# Altium schematic sheet Mako DSP Pro Main R1.0.SchDoc
size D
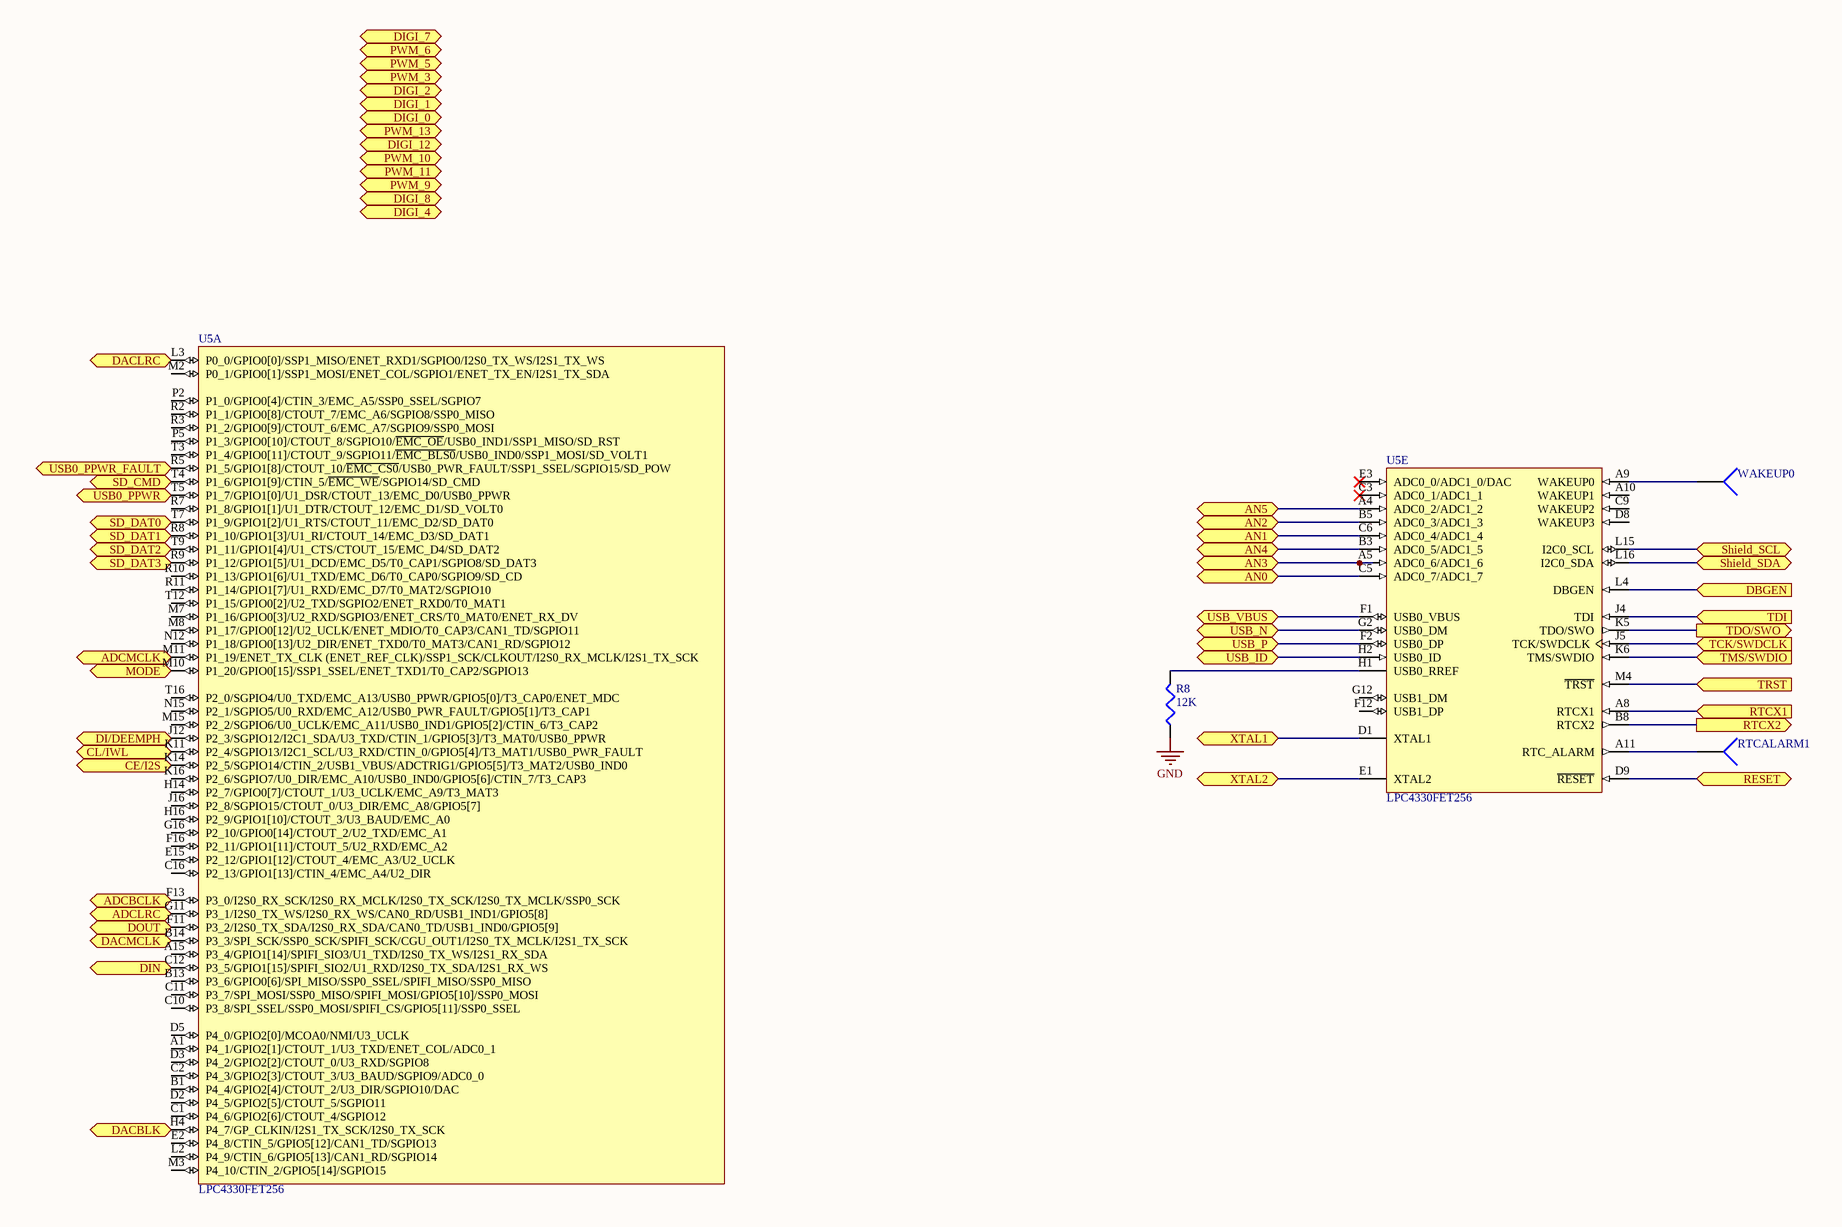
[diagram p0: Mako DSP Pro Main R1.0.SchDoc, top left]
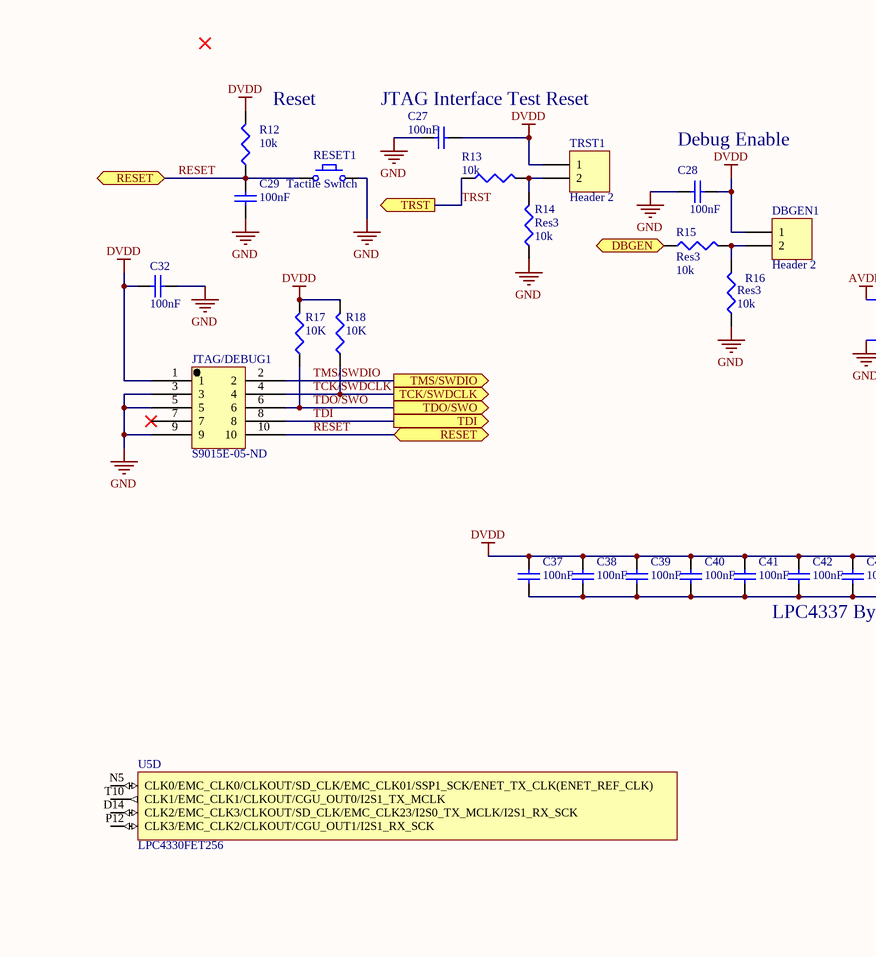
[diagram p1: Mako DSP Pro Main R1.0.SchDoc, bottom left]
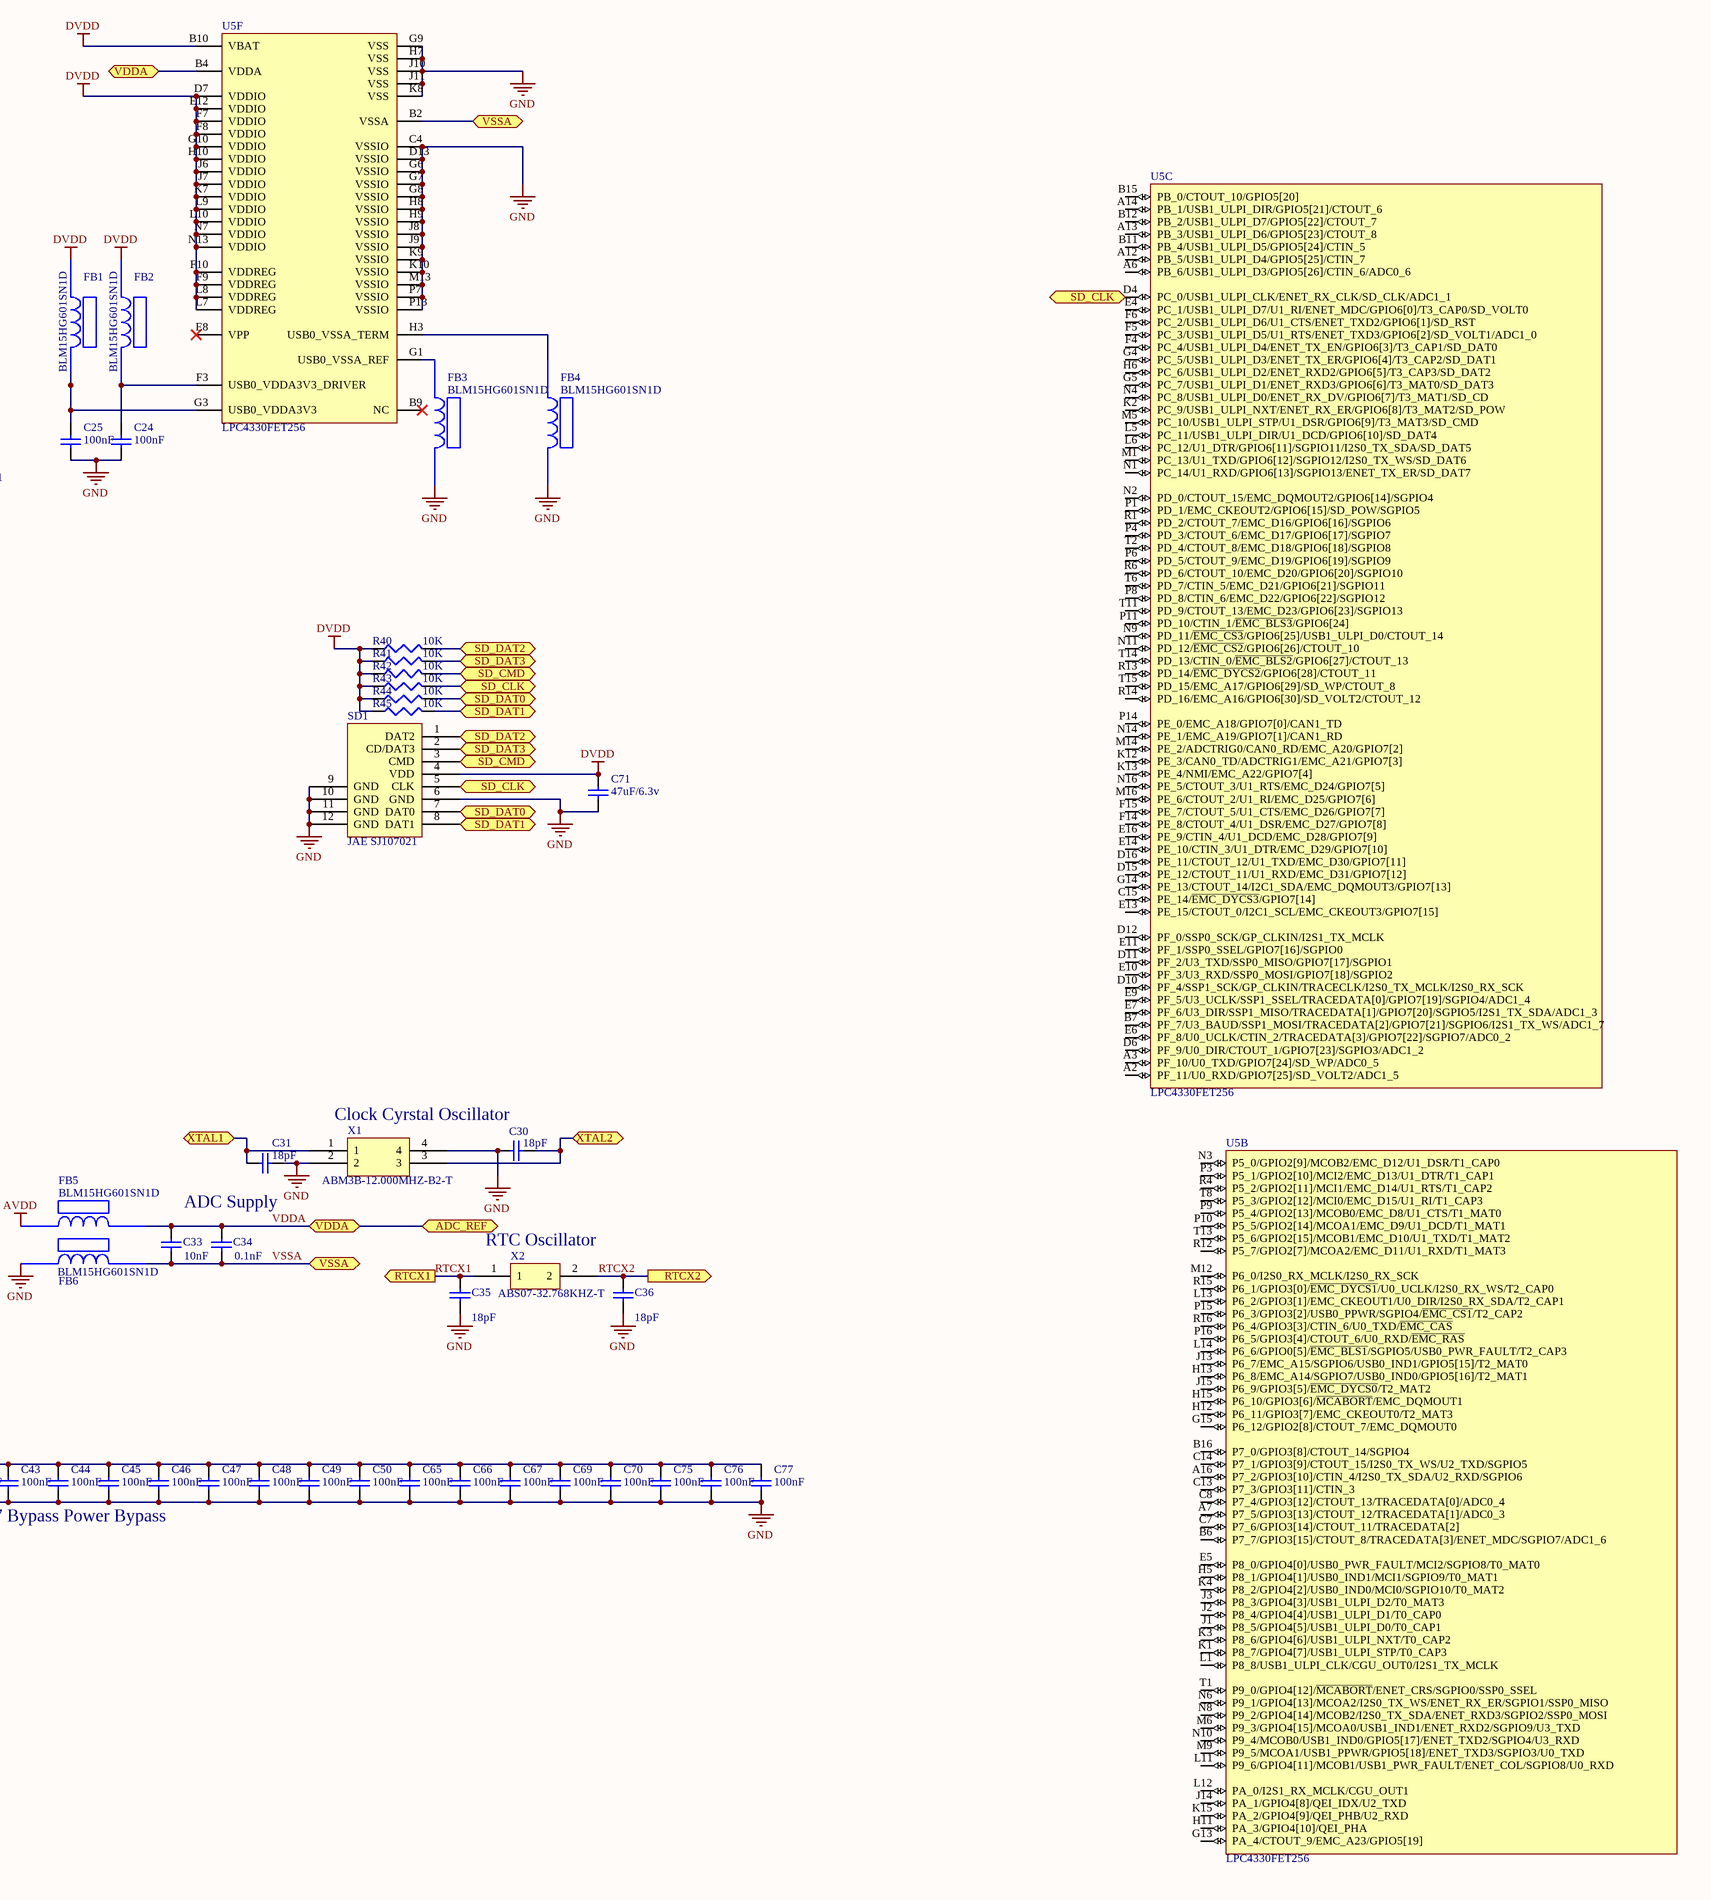
[diagram p2: Mako DSP Pro Main R1.0.SchDoc, bottom right]

## Parts
C24  value 100nF  [0402]  (hidden comment: Cap Semi)
C25  value 100nF  [0402]  (hidden comment: Cap Semi)
C27  C1: 100nF  [CAPC1608L]  (hidden comment: Cap Semi)
C28  C1: 100nF  [CAPC1608L]  (hidden comment: Cap Semi)
C29  C1: 100nF  [CAPC1608L]  (hidden comment: Cap Semi)
C30  value 18pF  [1608[0603]]  (hidden comment: Cap Semi)
C31  value 18pF  [1608[0603]]  (hidden comment: Cap Semi)
C32  C1: 100nF  [CAPC1608L]  (hidden comment: Cap Semi)
C33  value 10nF  [1608[0603]]  (hidden comment: Cap Semi)
C34  value 0.1nF  [1608[0603]]  (hidden comment: Cap Semi)
C35  value 18pF  [1608[0603]]  (hidden comment: Cap Semi)
C36  value 18pF  [1608[0603]]  (hidden comment: Cap Semi)
C37  value 100nF  [0402]  (hidden comment: Cap Semi)
C38  value 100nF  [0402]  (hidden comment: Cap Semi)
C39  value 100nF  [0402]  (hidden comment: Cap Semi)
C40  value 100nF  [0402]  (hidden comment: Cap Semi)
C41  value 100nF  [0402]  (hidden comment: Cap Semi)
C42  value 100nF  [0402]  (hidden comment: Cap Semi)
C43  value 100nF  [0402]  (hidden comment: Cap Semi)
C44  value 100nF  [0402]  (hidden comment: Cap Semi)
C45  value 100nF  [0402]  (hidden comment: Cap Semi)
C46  value 100nF  [0402]  (hidden comment: Cap Semi)
C47  value 100nF  [0402]  (hidden comment: Cap Semi)
C48  value 100nF  [0402]  (hidden comment: Cap Semi)
C49  value 100nF  [0402]  (hidden comment: Cap Semi)
C50  value 100nF  [0402]  (hidden comment: Cap Semi)
C65  value 100nF  [0402]  (hidden comment: Cap Semi)
C66  value 100nF  [0402]  (hidden comment: Cap Semi)
C67  value 100nF  [0402]  (hidden comment: Cap Semi)
C69  value 100nF  [0402]  (hidden comment: Cap Semi)
C70  value 100nF  [0402]  (hidden comment: Cap Semi)
C71  value 47uF/6.3v  [Panasonic VS B]  (hidden comment: Cap Semi)
C75  value 100nF  [0402]  (hidden comment: Cap Semi)
C76  value 100nF  [0402]  (hidden comment: Cap Semi)
C77  value 100nF  [0402]  (hidden comment: Cap Semi)
DBGEN1  Header 2  [HDR1X2]
FB1  BLM15HG601SN1D  [BLM18PG121SN1D]
FB2  BLM15HG601SN1D  [BLM18PG121SN1D]
FB3  BLM15HG601SN1D  [BLM18PG121SN1D]
FB4  BLM15HG601SN1D  [BLM18PG121SN1D]
FB5  BLM15HG601SN1D  [BLM18PG121SN1D]
FB6  BLM15HG601SN1D  [BLM18PG121SN1D]
JTAG/DEBUG1  S9015E-05-ND  [S9015E-05-ND]
R8  value 12K  [J1-0603]  (hidden comment: Res3)
R12  value 10k  [J1-0603]  (hidden comment: Res3)
R13  value 10k  [J1-0603]  (hidden comment: Res3)
R14  Res3  value 10k  [J1-0603]
R15  Res3  value 10k  [J1-0603]
R16  Res3  value 10k  [J1-0603]
R17  value 10K  [J1-0603]  (hidden comment: Res3)
R18  value 10K  [J1-0603]  (hidden comment: Res3)
R40  value 10K  [J1-0603]  (hidden comment: Res3)
R41  value 10K  [J1-0603]  (hidden comment: Res3)
R42  value 10K  [J1-0603]  (hidden comment: Res3)
R43  value 10K  [J1-0603]  (hidden comment: Res3)
R44  value 10K  [J1-0603]  (hidden comment: Res3)
R45  value 10K  [J1-0603]  (hidden comment: Res3)
RESET1  Tactile Switch  [TL3301]
RTCALARM1  Socket  [PIN1]  (value not drawn)
SD1  JAE SJ107021  [JAE SJ107021]
TRST1  Header 2  [HDR1X2]
U5  LPC4330FET256  [SOT740-2]  (parts A,B,C,D,E,F of 6)
WAKEUP0  Socket  [PIN1]  (value not drawn)
X1  ABM3B-12.000MHZ-B2-T  [ABM3B-12.000MHZ-B2-T]
X2  ABS07-32.768KHZ-T  [ABS07-32.768KHZ-T]

## Ports
ADC_REF, ADCBCLK (bidir), ADCLRC (bidir), ADCMCLK (bidir), AN0 (bidir), AN1 (bidir), AN2 (bidir), AN3 (bidir), AN4 (bidir), AN5 (bidir), CE/I2S (bidir), CL/IWL (bidir), DACBLK (bidir), DACLRC (bidir), DACMCLK (bidir), DBGEN (in), DBGEN (out), DI/DEEMPH (bidir), DIGI_0 (bidir), DIGI_1 (bidir), DIGI_2 (bidir), DIGI_4 (bidir), DIGI_7 (bidir), DIGI_8 (bidir), DIGI_12 (bidir), DIN (bidir), DOUT (bidir), MODE (bidir), PWM_3 (bidir), PWM_5 (bidir), PWM_6 (bidir), PWM_9 (bidir), PWM_10 (bidir), PWM_11 (bidir), PWM_13 (bidir), RESET (bidir), RTCX1 (in), RTCX1 (out), RTCX2 (out), SD_CLK (bidir), SD_CMD (bidir), SD_DAT0 (bidir), SD_DAT1 (bidir), SD_DAT2 (bidir), SD_DAT3 (bidir), Shield_SCL (bidir), Shield_SDA (bidir), TCK/SWDCLK (in), TCK/SWDCLK (out), TDI (in), TDI (out), TDO/SWO (out), TMS/SWDIO (in), TMS/SWDIO (out), TRST (in), TRST (out), USB0_PPWR (bidir), USB0_PPWR_FAULT (bidir), USB_ID (bidir), USB_N (bidir), USB_P (bidir), USB_VBUS (bidir), VDDA, VSSA, XTAL1 (bidir), XTAL2 (bidir)

## Nets
AVDD: FB5.1
DVDD: C27.2 C28.2 C32.1 C37.2 C38.2 C39.2 C40.2 C41.2 C42.2 C43.2 C44.2 C45.2 C46.2 C47.2 C48.2 C49.2 C50.2 C65.2 C66.2 C67.2 C69.2 C70.2 C71.2 C75.2 C76.2 C77.2 DBGEN1.1 FB1.1 FB2.1 JTAG/DEBUG1.1 R12.2 R17.2 R18.2 R40.1 R41.1 R42.1 R43.1 R44.1 R45.1 SD1.4(VDD) TRST1.1 U5.B10(VBAT) U5.D7(VDDIO) U5.E12(VDDIO) U5.F7(VDDIO) U5.F8(VDDIO) U5.F9(VDDREG) U5.F10(VDDREG) U5.G10(VDDIO) U5.H10(VDDIO) U5.J6(VDDIO) U5.J7(VDDIO) U5.K7(VDDIO) U5.L7(VDDREG) U5.L8(VDDREG) U5.L9(VDDIO) U5.L10(VDDIO) U5.N7(VDDIO) U5.N13(VDDIO)
GND: C24.1 C25.1 C27.1 C28.1 C29.1 C30.2 C31.1 C32.2 C35.1 C36.1 C37.1 C38.1 C39.1 C40.1 C41.1 C42.1 C43.1 C44.1 C45.1 C46.1 C47.1 C48.1 C49.1 C50.1 C65.1 C66.1 C67.1 C69.1 C70.1 C71.1 C75.1 C76.1 C77.1 FB3.2 FB4.2 FB6.1 JTAG/DEBUG1.3 JTAG/DEBUG1.5 JTAG/DEBUG1.9 R8.1 R14.1 R16.1 RESET1.2 SD1.6(GND) SD1.9(GND) SD1.10(GND) SD1.11(GND) SD1.12(GND) U5.C4(VSSIO) U5.D13(VSSIO) U5.G6(VSSIO) U5.G7(VSSIO) U5.G8(VSSIO) U5.G9(VSS) U5.H7(VSS) U5.H8(VSSIO) U5.H9(VSSIO) U5.J8(VSSIO) U5.J9(VSSIO) U5.J10(VSS) U5.J11(VSS) U5.K8(VSS) U5.K9(VSSIO) U5.K10(VSSIO) U5.M13(VSSIO) U5.P7(VSSIO) U5.P13(VSSIO) X1.2 X1.4
ADCBCLK: U5.F13(P3_0/I2S0_RX_SCK/I2S0_RX_MCLK/I2S0_TX_SCK/I2S0_TX_MCLK/SSP0_SCK) ; port ADCBCLK
ADCLRC: U5.G11(P3_1/I2S0_TX_WS/I2S0_RX_WS/CAN0_RD/USB1_IND1/GPIO5[8]) ; port ADCLRC
ADCMCLK: U5.M11(P1_19/ENET_TX_CLK_(ENET_REF_CLK)/SSP1_SCK/CLKOUT/I2S0_RX_MCLK/I2S1_TX_SCK) ; port ADCMCLK
AN0: U5.C5(ADC0_7/ADC1_7) ; port AN0
AN1: U5.C6(ADC0_4/ADC1_4) ; port AN1
AN2: U5.B5(ADC0_3/ADC1_3) ; port AN2
AN3: U5.A5(ADC0_6/ADC1_6) ; port AN3
AN4: U5.B3(ADC0_5/ADC1_5) ; port AN4
AN5: U5.A4(ADC0_2/ADC1_2) ; port AN5
CE/I2S: U5.K14(P2_5/SGPIO14/CTIN_2/USB1_VBUS/ADCTRIG1/GPIO5[5]/T3_MAT2/USB0_IND0) ; port CE/I2S
CL/IWL: U5.K11(P2_4/SGPIO13/I2C1_SCL/U3_RXD/CTIN_0/GPIO5[4]/T3_MAT1/USB0_PWR_FAULT) ; port CL/IWL
DACBLK: U5.H4(P4_7/GP_CLKIN/I2S1_TX_SCK/I2S0_TX_SCK) ; port DACBLK
DACLRC: U5.L3(P0_0/GPIO0[0]/SSP1_MISO/ENET_RXD1/SGPIO0/I2S0_TX_WS/I2S1_TX_WS) ; port DACLRC
DACMCLK: U5.B14(P3_3/SPI_SCK/SSP0_SCK/SPIFI_SCK/CGU_OUT1/I2S0_TX_MCLK/I2S1_TX_SCK) ; port DACMCLK
DBGEN: R15.1 U5.L4(DBGEN) ; port DBGEN
DI/DEEMPH: U5.J12(P2_3/SGPIO12/I2C1_SDA/U3_TXD/CTIN_1/GPIO5[3]/T3_MAT0/USB0_PPWR) ; port DI/DEEMPH
DIN: U5.C12(P3_5/GPIO1[15]/SPIFI_SIO2/U1_RXD/I2S0_TX_SDA/I2S1_RX_WS) ; port DIN
DOUT: U5.F11(P3_2/I2S0_TX_SDA/I2S0_RX_SDA/CAN0_TD/USB1_IND0/GPIO5[9]) ; port DOUT
MODE: U5.M10(P1_20/GPIO0[15]/SSP1_SSEL/ENET_TXD1/T0_CAP2/SGPIO13) ; port MODE
RESET: C29.2 JTAG/DEBUG1.10 R12.1 RESET1.1 U5.D9(~{RESET}) ; port RESET
RTCX1: C35.2 U5.A8(RTCX1) X2.1 ; port RTCX1
RTCX2: C36.2 U5.B8(RTCX2) X2.2 ; port RTCX2
SD_CLK: R43.2 SD1.5(CLK) U5.D4(PC_0/USB1_ULPI_CLK/ENET_RX_CLK/SD_CLK/ADC1_1) ; port SD_CLK
SD_CMD: R42.2 SD1.3(CMD) U5.T4(P1_6/GPIO1[9]/CTIN_5/~{EMC_WE}/SGPIO14/SD_CMD) ; port SD_CMD
SD_DAT0: R44.2 SD1.7(DAT0) U5.T7(P1_9/GPIO1[2]/U1_RTS/CTOUT_11/EMC_D2/SD_DAT0) ; port SD_DAT0
SD_DAT1: R45.2 SD1.8(DAT1) U5.R8(P1_10/GPIO1[3]/U1_RI/CTOUT_14/EMC_D3/SD_DAT1) ; port SD_DAT1
SD_DAT2: R40.2 SD1.1(DAT2) U5.T9(P1_11/GPIO1[4]/U1_CTS/CTOUT_15/EMC_D4/SD_DAT2) ; port SD_DAT2
SD_DAT3: R41.2 SD1.2(CD/DAT3) U5.R9(P1_12/GPIO1[5]/U1_DCD/EMC_D5/T0_CAP1/SGPIO8/SD_DAT3) ; port SD_DAT3
Shield_SCL: U5.L15(I2C0_SCL) ; port Shield_SCL
Shield_SDA: U5.L16(I2C0_SDA) ; port Shield_SDA
TCK/SWDCLK: JTAG/DEBUG1.4 R18.1 U5.J5(TCK/SWDCLK) ; port TCK/SWDCLK
TDI: JTAG/DEBUG1.8 U5.J4(TDI) ; port TDI
TDO/SWO: JTAG/DEBUG1.6 R17.1 U5.K5(TDO/SWO) ; port TDO/SWO
TMS/SWDIO: JTAG/DEBUG1.2 U5.K6(TMS/SWDIO) ; port TMS/SWDIO
TRST: R13.1 U5.M4(~{TRST}) ; port TRST
USB0_PPWR: U5.T5(P1_7/GPIO1[0]/U1_DSR/CTOUT_13/EMC_D0/USB0_PPWR) ; port USB0_PPWR
USB0_PPWR_FAULT: U5.R5(P1_5/GPIO1[8]/CTOUT_10/~{EMC_CS0}/USB0_PWR_FAULT/SSP1_SSEL/SGPIO15/SD_POW) ; port USB0_PPWR_FAULT
USB_ID: U5.H2(USB0_ID) ; port USB_ID
USB_N: U5.G2(USB0_DM) ; port USB_N
USB_P: U5.F2(USB0_DP) ; port USB_P
USB_VBUS: U5.F1(USB0_VBUS) ; port USB_VBUS
VDDA: C33.2 C34.2 FB5.2 U5.B4(VDDA) ; port VDDA, port ADC_REF
VSSA: C33.1 C34.1 FB6.2 U5.B2(VSSA) ; port VSSA
XTAL1: C31.2 U5.D1(XTAL1) X1.1 ; port XTAL1
XTAL2: C30.1 U5.E1(XTAL2) X1.3 ; port XTAL2
NetC24_2: C24.2 FB2.2 U5.F3(USB0_VDDA3V3_DRIVER)
NetC25_2: C25.2 FB1.2 U5.G3(USB0_VDDA3V3)
NetDBGEN1_2: DBGEN1.2 R15.2 R16.2
NetFB3_1: FB3.1 U5.G1(USB0_VSSA_REF)
NetFB4_1: FB4.1 U5.H3(USB0_VSSA_TERM)
NetR8_2: R8.2 U5.H1(USB0_RREF)
NetR13_2: R13.2 R14.2 TRST1.2
NetRTCALARM1_1: RTCALARM1.1 U5.A11(RTC_ALARM)
NetU5_A9: U5.A9(WAKEUP0) WAKEUP0.1

Not connected (* = marked no-connect by the designer): JTAG/DEBUG1 7*; U5 A1(P4_1/GPIO2[1]/CTOUT_1/U3_TXD/ENET_COL/ADC0_1) A2(PF_11/U0_RXD/GPIO7[25]/SD_VOLT2/ADC1_5) A3(PF_10/U0_TXD/GPIO7[24]/SD_WP/ADC0_5) A6(PB_6/USB1_ULPI_D3/GPIO5[26]/CTIN_6/ADC0_6) A7(P7_5/GPIO3[13]/CTOUT_12/TRACEDATA[1]/ADC0_3) A10(WAKEUP1) A12(PB_5/USB1_ULPI_D4/GPIO5[25]/CTIN_7) A13(PB_3/USB1_ULPI_D6/GPIO5[23]/CTOUT_8) A14(PB_1/USB1_ULPI_DIR/GPIO5[21]/CTOUT_6) A15(P3_4/GPIO1[14]/SPIFI_SIO3/U1_TXD/I2S0_TX_WS/I2S1_RX_SDA) A16(P7_2/GPIO3[10]/CTIN_4/I2S0_TX_SDA/U2_RXD/SGPIO6) B1(P4_4/GPIO2[4]/CTOUT_2/U3_DIR/SGPIO10/DAC) B6(P7_7/GPIO3[15]/CTOUT_8/TRACEDATA[3]/ENET_MDC/SGPIO7/ADC1_6) B7(PF_7/U3_BAUD/SSP1_MOSI/TRACEDATA[2]/GPIO7[21]/SGPIO6/I2S1_TX_WS/ADC1_7) B9(NC)* B11(PB_4/USB1_ULPI_D5/GPIO5[24]/CTIN_5) B12(PB_2/USB1_ULPI_D7/GPIO5[22]/CTOUT_7) B13(P3_6/GPIO0[6]/SPI_MISO/SSP0_SSEL/SPIFI_MISO/SSP0_MISO) B15(PB_0/CTOUT_10/GPIO5[20]) B16(P7_0/GPIO3[8]/CTOUT_14/SGPIO4) C1(P4_6/GPIO2[6]/CTOUT_4/SGPIO12) C2(P4_3/GPIO2[3]/CTOUT_3/U3_BAUD/SGPIO9/ADC0_0) C3(ADC0_1/ADC1_1)* C7(P7_6/GPIO3[14]/CTOUT_11/TRACEDATA[2]) C8(P7_4/GPIO3[12]/CTOUT_13/TRACEDATA[0]/ADC0_4) C9(WAKEUP2) C10(P3_8/SPI_SSEL/SSP0_MOSI/SPIFI_CS/GPIO5[11]/SSP0_SSEL) C11(P3_7/SPI_MOSI/SSP0_MISO/SPIFI_MOSI/GPIO5[10]/SSP0_MOSI) C13(P7_3/GPIO3[11]/CTIN_3) C14(P7_1/GPIO3[9]/CTOUT_15/I2S0_TX_WS/U2_TXD/SGPIO5) C15(PE_14/~{EMC_DYCS3}/GPIO7[14]) C16(P2_13/GPIO1[13]/CTIN_4/EMC_A4/U2_DIR) D2(P4_5/GPIO2[5]/CTOUT_5/SGPIO11) D3(P4_2/GPIO2[2]/CTOUT_0/U3_RXD/SGPIO8) D5(P4_0/GPIO2[0]/MCOA0/NMI/U3_UCLK) D6(PF_9/U0_DIR/CTOUT_1/GPIO7[23]/SGPIO3/ADC1_2) D8(WAKEUP3) D10(PF_4/SSP1_SCK/GP_CLKIN/TRACECLK/I2S0_TX_MCLK/I2S0_RX_SCK) D11(PF_2/U3_TXD/SSP0_MISO/GPIO7[17]/SGPIO1) D12(PF_0/SSP0_SCK/GP_CLKIN/I2S1_TX_MCLK) D14(CLK2/EMC_CLK3/CLKOUT/SD_CLK/EMC_CLK23/I2S0_TX_MCLK/I2S1_RX_SCK) D15(PE_12/CTOUT_11/U1_RXD/EMC_D31/GPIO7[12]) D16(PE_11/CTOUT_12/U1_TXD/EMC_D30/GPIO7[11]) E2(P4_8/CTIN_5/GPIO5[12]/CAN1_TD/SGPIO13) E3(ADC0_0/ADC1_0/DAC)* E4(PC_1/USB1_ULPI_D7/U1_RI/ENET_MDC/GPIO6[0]/T3_CAP0/SD_VOLT0) E5(P8_0/GPIO4[0]/USB0_PWR_FAULT/MCI2/SGPIO8/T0_MAT0) E6(PF_8/U0_UCLK/CTIN_2/TRACEDATA[3]/GPIO7[22]/SGPIO7/ADC0_2) E7(PF_6/U3_DIR/SSP1_MISO/TRACEDATA[1]/GPIO7[20]/SGPIO5/I2S1_TX_SDA/ADC1_3) E8(VPP)* E9(PF_5/U3_UCLK/SSP1_SSEL/TRACEDATA[0]/GPIO7[19]/SGPIO4/ADC1_4) E10(PF_3/U3_RXD/SSP0_MOSI/GPIO7[18]/SGPIO2) E11(PF_1/SSP0_SSEL/GPIO7[16]/SGPIO0) E13(PE_15/CTOUT_0/I2C1_SCL/EMC_CKEOUT3/GPIO7[15]) E14(PE_10/CTIN_3/U1_DTR/EMC_D29/GPIO7[10]) E15(P2_12/GPIO1[12]/CTOUT_4/EMC_A3/U2_UCLK) E16(PE_9/CTIN_4/U1_DCD/EMC_D28/GPIO7[9]) F4(PC_4/USB1_ULPI_D4/ENET_TX_EN/GPIO6[3]/T3_CAP1/SD_DAT0) F5(PC_3/USB1_ULPI_D5/U1_RTS/ENET_TXD3/GPIO6[2]/SD_VOLT1/ADC1_0) F6(PC_2/USB1_ULPI_D6/U1_CTS/ENET_TXD2/GPIO6[1]/SD_RST) F12(USB1_DP) F14(PE_8/CTOUT_4/U1_DSR/EMC_D27/GPIO7[8]) F15(PE_7/CTOUT_5/U1_CTS/EMC_D26/GPIO7[7]) F16(P2_11/GPIO1[11]/CTOUT_5/U2_RXD/EMC_A2) G4(PC_5/USB1_ULPI_D3/ENET_TX_ER/GPIO6[4]/T3_CAP2/SD_DAT1) G5(PC_7/USB1_ULPI_D1/ENET_RXD3/GPIO6[6]/T3_MAT0/SD_DAT3) G12(USB1_DM) G13(PA_4/CTOUT_9/EMC_A23/GPIO5[19]) G14(PE_13/CTOUT_14/I2C1_SDA/EMC_DQMOUT3/GPIO7[13]) G15(P6_12/GPIO2[8]/CTOUT_7/EMC_DQMOUT0) G16(P2_10/GPIO0[14]/CTOUT_2/U2_TXD/EMC_A1) H5(P8_1/GPIO4[1]/USB0_IND1/MCI1/SGPIO9/T0_MAT1) H6(PC_6/USB1_ULPI_D2/ENET_RXD2/GPIO6[5]/T3_CAP3/SD_DAT2) H11(PA_3/GPIO4[10]/QEI_PHA) H12(P6_11/GPIO3[7]/EMC_CKEOUT0/T2_MAT3) H13(P6_8/EMC_A14/SGPIO7/USB0_IND0/GPIO5[16]/T2_MAT1) H14(P2_7/GPIO0[7]/CTOUT_1/U3_UCLK/EMC_A9/T3_MAT3) H15(P6_10/GPIO3[6]/~{MCABORT}/EMC_DQMOUT1) H16(P2_9/GPIO1[10]/CTOUT_3/U3_BAUD/EMC_A0) J1(P8_5/GPIO4[5]/USB1_ULPI_D0/T0_CAP1) J2(P8_4/GPIO4[4]/USB1_ULPI_D1/T0_CAP0) J3(P8_3/GPIO4[3]/USB1_ULPI_D2/T0_MAT3) J13(P6_7/EMC_A15/SGPIO6/USB0_IND1/GPIO5[15]/T2_MAT0) J14(PA_1/GPIO4[8]/QEI_IDX/U2_TXD) J15(P6_9/GPIO3[5]/~{EMC_DYCS0}/T2_MAT2) J16(P2_8/SGPIO15/CTOUT_0/U3_DIR/EMC_A8/GPIO5[7]) K1(P8_7/GPIO4[7]/USB1_ULPI_STP/T0_CAP3) K2(PC_9/USB1_ULPI_NXT/ENET_RX_ER/GPIO6[8]/T3_MAT2/SD_POW) K3(P8_6/GPIO4[6]/USB1_ULPI_NXT/T0_CAP2) K4(P8_2/GPIO4[2]/USB0_IND0/MCI0/SGPIO10/T0_MAT2) K12(PE_3/CAN0_TD/ADCTRIG1/EMC_A21/GPIO7[3]) K13(PE_4/NMI/EMC_A22/GPIO7[4]) K15(PA_2/GPIO4[9]/QEI_PHB/U2_RXD) K16(P2_6/SGPIO7/U0_DIR/EMC_A10/USB0_IND0/GPIO5[6]/CTIN_7/T3_CAP3) L1(P8_8/USB1_ULPI_CLK/CGU_OUT0/I2S1_TX_MCLK) L2(P4_9/CTIN_6/GPIO5[13]/CAN1_RD/SGPIO14) L5(PC_11/USB1_ULPI_DIR/U1_DCD/GPIO6[10]/SD_DAT4) L6(PC_12/U1_DTR/GPIO6[11]/SGPIO11/I2S0_TX_SDA/SD_DAT5) L11(P9_6/GPIO4[11]/MCOB1/USB1_PWR_FAULT/ENET_COL/SGPIO8/U0_RXD) L12(PA_0/I2S1_RX_MCLK/CGU_OUT1) L13(P6_2/GPIO3[1]/EMC_CKEOUT1/U0_DIR/I2S0_RX_SDA/T2_CAP1) L14(P6_6/GPIO0[5]/~{EMC_BLS1}/SGPIO5/USB0_PWR_FAULT/T2_CAP3) M1(PC_13/U1_TXD/GPIO6[12]/SGPIO12/I2S0_TX_WS/SD_DAT6) M2(P0_1/GPIO0[1]/SSP1_MOSI/ENET_COL/SGPIO1/ENET_TX_EN/I2S1_TX_SDA) M3(P4_10/CTIN_2/GPIO5[14]/SGPIO15) M5(PC_10/USB1_ULPI_STP/U1_DSR/GPIO6[9]/T3_MAT3/SD_CMD) M6(P9_3/GPIO4[15]/MCOA0/USB1_IND1/ENET_RXD2/SGPIO9/U3_TXD) M7(P1_16/GPIO0[3]/U2_RXD/SGPIO3/ENET_CRS/T0_MAT0/ENET_RX_DV) M8(P1_17/GPIO0[12]/U2_UCLK/ENET_MDIO/T0_CAP3/CAN1_TD/SGPIO11) M9(P9_5/MCOA1/USB1_PPWR/GPIO5[18]/ENET_TXD3/SGPIO3/U0_TXD) M12(P6_0/I2S0_RX_MCLK/I2S0_RX_SCK) M14(PE_2/ADCTRIG0/CAN0_RD/EMC_A20/GPIO7[2]) M15(P2_2/SGPIO6/U0_UCLK/EMC_A11/USB0_IND1/GPIO5[2]/CTIN_6/T3_CAP2) M16(PE_6/CTOUT_2/U1_RI/EMC_D25/GPIO7[6]) N1(PC_14/U1_RXD/GPIO6[13]/SGPIO13/ENET_TX_ER/SD_DAT7) N2(PD_0/CTOUT_15/EMC_DQMOUT2/GPIO6[14]/SGPIO4) N3(P5_0/GPIO2[9]/MCOB2/EMC_D12/U1_DSR/T1_CAP0) N4(PC_8/USB1_ULPI_D0/ENET_RX_DV/GPIO6[7]/T3_MAT1/SD_CD) N5(CLK0/EMC_CLK0/CLKOUT/SD_CLK/EMC_CLK01/SSP1_SCK/ENET_TX_CLK(ENET_REF_CLK)) N6(P9_1/GPIO4[13]/MCOA2/I2S0_TX_WS/ENET_RX_ER/SGPIO1/SSP0_MISO) N8(P9_2/GPIO4[14]/MCOB2/I2S0_TX_SDA/ENET_RXD3/SGPIO2/SSP0_MOSI) N9(PD_11/~{EMC_CS3}/GPIO6[25]/USB1_ULPI_D0/CTOUT_14) N10(P9_4/MCOB0/USB1_IND0/GPIO5[17]/ENET_TXD2/SGPIO4/U3_RXD) N11(PD_12/~{EMC_CS2}/GPIO6[26]/CTOUT_10) N12(P1_18/GPIO0[13]/U2_DIR/ENET_TXD0/T0_MAT3/CAN1_RD/SGPIO12) N14(PE_1/EMC_A19/GPIO7[1]/CAN1_RD) N15(P2_1/SGPIO5/U0_RXD/EMC_A12/USB0_PWR_FAULT/GPIO5[1]/T3_CAP1) N16(PE_5/CTOUT_3/U1_RTS/EMC_D24/GPIO7[5]) P1(PD_1/EMC_CKEOUT2/GPIO6[15]/SD_POW/SGPIO5) P2(P1_0/GPIO0[4]/CTIN_3/EMC_A5/SSP0_SSEL/SGPIO7) P3(P5_1/GPIO2[10]/MCI2/EMC_D13/U1_DTR/T1_CAP1) P4(PD_3/CTOUT_6/EMC_D17/GPIO6[17]/SGPIO7) P5(P1_3/GPIO0[10]/CTOUT_8/SGPIO10/~{EMC_OE}/USB0_IND1/SSP1_MISO/SD_RST) P6(PD_5/CTOUT_9/EMC_D19/GPIO6[19]/SGPIO9) P8(PD_8/CTIN_6/EMC_D22/GPIO6[22]/SGPIO12) P9(P5_4/GPIO2[13]/MCOB0/EMC_D8/U1_CTS/T1_MAT0) P10(P5_5/GPIO2[14]/MCOA1/EMC_D9/U1_DCD/T1_MAT1) P11(PD_10/CTIN_1/~{EMC_BLS3}/GPIO6[24]) P12(CLK3/EMC_CLK2/CLKOUT/CGU_OUT1/I2S1_RX_SCK) P14(PE_0/EMC_A18/GPIO7[0]/CAN1_TD) P15(P6_3/GPIO3[2]/USB0_PPWR/SGPIO4/~{EMC_CS1}/T2_CAP2) P16(P6_5/GPIO3[4]/CTOUT_6/U0_RXD/~{EMC_RAS}) R1(PD_2/CTOUT_7/EMC_D16/GPIO6[16]/SGPIO6) R2(P1_1/GPIO0[8]/CTOUT_7/EMC_A6/SGPIO8/SSP0_MISO) R3(P1_2/GPIO0[9]/CTOUT_6/EMC_A7/SGPIO9/SSP0_MOSI) R4(P5_2/GPIO2[11]/MCI1/EMC_D14/U1_RTS/T1_CAP2) R6(PD_6/CTOUT_10/EMC_D20/GPIO6[20]/SGPIO10) R7(P1_8/GPIO1[1]/U1_DTR/CTOUT_12/EMC_D1/SD_VOLT0) R10(P1_13/GPIO1[6]/U1_TXD/EMC_D6/T0_CAP0/SGPIO9/SD_CD) R11(P1_14/GPIO1[7]/U1_RXD/EMC_D7/T0_MAT2/SGPIO10) R12(P5_7/GPIO2[7]/MCOA2/EMC_D11/U1_RXD/T1_MAT3) R13(PD_14/~{EMC_DYCS2}/GPIO6[28]/CTOUT_11) R14(PD_16/EMC_A16/GPIO6[30]/SD_VOLT2/CTOUT_12) R15(P6_1/GPIO3[0]/~{EMC_DYCS1}/U0_UCLK/I2S0_RX_WS/T2_CAP0) R16(P6_4/GPIO3[3]/CTIN_6/U0_TXD/~{EMC_CAS}) T1(P9_0/GPIO4[12]/~{MCABORT}/ENET_CRS/SGPIO0/SSP0_SSEL) T2(PD_4/CTOUT_8/EMC_D18/GPIO6[18]/SGPIO8) T3(P1_4/GPIO0[11]/CTOUT_9/SGPIO11/~{EMC_BLS0}/USB0_IND0/SSP1_MOSI/SD_VOLT1) T6(PD_7/CTIN_5/EMC_D21/GPIO6[21]/SGPIO11) T8(P5_3/GPIO2[12]/MCI0/EMC_D15/U1_RI/T1_CAP3) T10(CLK1/EMC_CLK1/CLKOUT/CGU_OUT0/I2S1_TX_MCLK) T11(PD_9/CTOUT_13/EMC_D23/GPIO6[23]/SGPIO13) T12(P1_15/GPIO0[2]/U2_TXD/SGPIO2/ENET_RXD0/T0_MAT1) T13(P5_6/GPIO2[15]/MCOB1/EMC_D10/U1_TXD/T1_MAT2) T14(PD_13/CTIN_0/~{EMC_BLS2}/GPIO6[27]/CTOUT_13) T15(PD_15/EMC_A17/GPIO6[29]/SD_WP/CTOUT_8) T16(P2_0/SGPIO4/U0_TXD/EMC_A13/USB0_PPWR/GPIO5[0]/T3_CAP0/ENET_MDC)

## Notes on the sheet
- (near R12) Reset
- (near C27) JTAG Interface Test Reset
- (near C28) Debug Enable
- Clock Cyrstal Oscillator
- ADC Supply
- RTC Oscillator
- LPC4337 Bypass Power Bypass

## Library data of the parts
C24 C25 C27-C50 C65-C67 C69-C71 C75-C77 = Cap Semi: Capacitor (Semiconductor SIM Model); Published: 8-Jun-2000; LatestRevisionDate: 29-May-2009; LatestRevisionNote: IPC-7351 Footprint Added.; PackageReference: C1206; Publisher: Altium Limited; PackageDescription: Chip Capacitor
DBGEN1 TRST1 = Header 2: Header, 2-Pin; LatestRevisionDate: 17-Jul-2002; LatestRevisionNote: Re-released for DXP Platform.; Publisher: Altium Limited
R8 R12-R18 R40-R45 = Res3: Resistor; Published: 8-Jun-2000; LatestRevisionDate: 29-May-2009; LatestRevisionNote: IPC-7351 Footprint Added.; PackageReference: J1-0603; Publisher: Altium Limited; PackageDescription: Chip Resistor
SD1 = JAE SJ107021 microSD Card Socket
U5 = LPC4330FET256: 32-bit ARM Cortex-M4 MCU, 264 kB SRAM, 2 HS USB with on-chip PHY, Ethernet, CAN, AES, SPIFI, SGPIO, SCT, 256-Pin LBGA; fmax: 204 MHz; GPIOs: 164; SRAM: 264 kB; ROM: 64 kB; Ethernet: Y; USB: 2; ADC channels: 8; SPI: 1; UART: 4; VDD (min): 2.2 V; VDD (max): 3.6 V; DatasheetVersion: Rev.3.1, Jan-2012; PackageVersion: Aug-2005; PackageReference: SOT740-2; PackageDescription: LBGA256: Plastic Low Profile Ball Grid Array Package; 256 Balls; Body 17 x 17 x 1 mm; PWM: Y; QEI: Y; PLL: Y; I2C: 2; CAN: 2; Timers: 4; Code_JEDEC: MO-192; ComponentLink1Description: Manufacturer URL; ComponentLink1URL: http://www.nxp.com/; ComponentLink2Description: Datasheet; ComponentLink2URL: http://www.nxp.com/documents/data_sheet/LPC4350_30_20_10.pdf
X2 = ABS07-32.768KHZ-T: ABS07-32.768KHZ-T RTC Crystal Oscillator
RTCALARM1 WAKEUP0 = Socket: LatestRevisionDate: 17-Jul-2002; LatestRevisionNote: Re-released for DXP Platform.; Publisher: Altium Limited